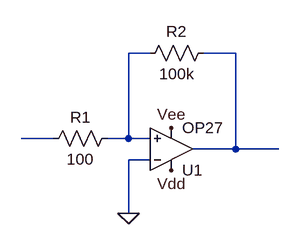
[diagram p0: schematic Draft9.asc]
Draft9.asc, the LTspice schematic file:
Version 4
SHEET 1 880 680
WIRE 80 80 48 80
WIRE 208 80 160 80
WIRE -64 208 -112 208
WIRE 48 208 48 80
WIRE 48 208 16 208
WIRE 80 208 48 208
WIRE 208 224 208 80
WIRE 208 224 144 224
WIRE 272 224 208 224
WIRE 80 240 48 240
WIRE 48 320 48 240
FLAG 112 256 Vdd
FLAG 112 192 Vee
FLAG 48 320 0
SYMBOL Opamps\\OP27 112 288 M180
SYMATTR InstName U1
SYMBOL res 32 192 R90
WINDOW 0 0 56 VBottom 2
WINDOW 3 32 56 VTop 2
SYMATTR InstName R1
SYMATTR Value 100
SYMBOL res 176 64 R90
WINDOW 0 0 56 VBottom 2
WINDOW 3 32 56 VTop 2
SYMATTR InstName R2
SYMATTR Value 100k

The netlist it stands for:
* Draft9.asc
XU1 N001 0 Vdd Vee N002 OP27  ; pins In+ In- V+ V- OUT
R1 N001 N003 100
R2 N002 N001 100k
.lib ADI.lib
.backanno
.end